# EAGLE schematic gate (EAGLE 9.3.2)
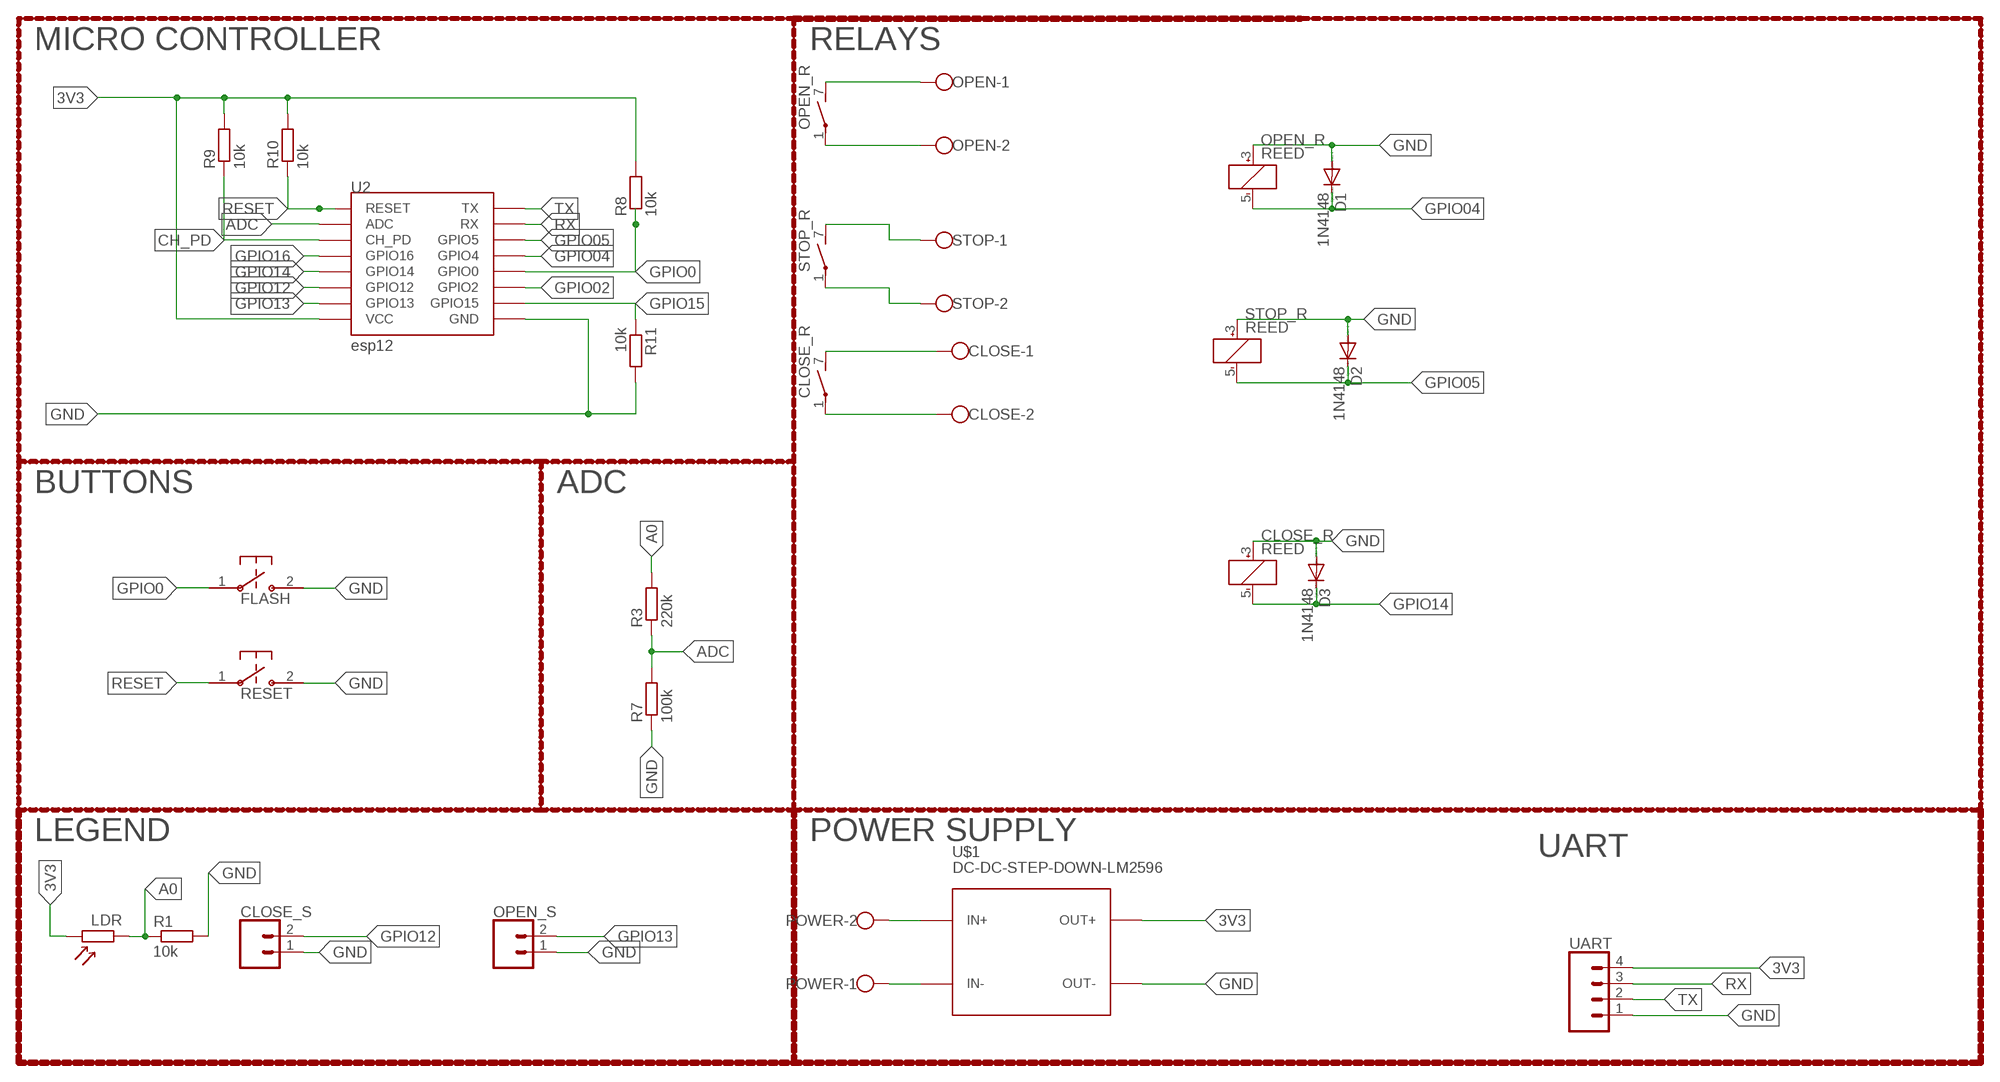
[diagram p0: schematic, sheet 1]

## Parts
CLOSE  W237-102  [W237-102]
CLOSE_R  REED  [REED]
CLOSE_S  CONN_023.5MM  [SCREWTERMINAL-3.5MM-2]
D1  1N4148  DIODE-SOD80C  [SOD80C]
D2  1N4148  DIODE-SOD80C  [SOD80C]
D3  1N4148  DIODE-SOD80C  [SOD80C]
FLASH  B3U-1000P-2P-SMD  B3U-1000P  [B3U-1000P]
LDR  LDR-TH  [1X02]
OPEN  W237-102  [W237-102]
OPEN_R  REED  [REED]
OPEN_S  CONN_023.5MM  [SCREWTERMINAL-3.5MM-2]
POWER  W237-102  [W237-102]
R1  10k  R-EU_R0603  [R0603]
R3  220k  R-EU_R0603  [R0603]
R7  100k  R-EU_R0603  [R0603]
R8  10k  R-EU_R0603  [R0603]
R9  10k  R-EU_R0603  [R0603]
R10  10k  R-EU_R0603  [R0603]
R11  10k  R-EU_R0603  [R0603]
RESET  B3U-1000P-2P-SMD  B3U-1000P  [B3U-1000P]
STOP  W237-102  [W237-102]
STOP_R  REED  [REED]
U2  esp12  ESP12SMD  [ESP12-SMD]
U$1  DC-DC-STEP-DOWN-LM2596  [DC-DC-STEP-DOWN-LM2596]
UART  CONN_04SCREW  [SCREWTERMINAL-3.5MM-4]

## Nets
3V3: LDR.2 R8.2 R9.2 R10.2 U2.VCC U$1.OUT+ UART.4
A0: LDR.1 R1.1 R3.2
ADC: R3.1 R7.2 U2.ADC
CH_PD: R9.1 U2.CH_PD
GND: CLOSE_R.3(1:+) CLOSE_S.1 D1.A D2.A D3.A FLASH.2 OPEN_R.3(1:+) OPEN_S.1 POWER.1 R1.2 R7.1 R11.2 RESET.2 STOP_R.3(1:+) U2.GND U$1.IN- U$1.OUT- UART.1
GND1: OPEN.1 OPEN_R.7(2:S)
GND2: STOP.1 STOP_R.7(2:S)
GND3: CLOSE.1 CLOSE_R.7(2:S)
GPIO0: FLASH.1 R8.1 U2.GPIO0
GPIO02: U2.GPIO2
GPIO04: D1.C OPEN_R.5(1:-) U2.GPIO4
GPIO05: D2.C STOP_R.5(1:-) U2.GPIO5
GPIO12: CLOSE_S.2 U2.GPIO12
GPIO13: OPEN_S.2 U2.GPIO13
GPIO14: CLOSE_R.5(1:-) D3.C U2.GPIO14
GPIO15: R11.1 U2.GPIO15
GPIO16: U2.GPIO16
N$1: OPEN.2 OPEN_R.1(2:P)
N$2: STOP.2 STOP_R.1(2:P)
N$3: CLOSE.2 CLOSE_R.1(2:P)
N$17: POWER.2 U$1.IN+
RESET: R10.1 RESET.1 U2.RESET
RX: U2.RXD0(RX) UART.3
TX: U2.TXD0(TX) UART.2

## Notes on the sheet
- MICRO CONTROLLER | RELAYS
- BUTTONS | ADC
- LEGEND | POWER SUPPLY
- UART

## Library data of the parts
CLOSE OPEN POWER STOP = con-wago-500:W237-102: WAGO SCREW CLAMP; MPN: 237-102; OC_FARNELL: unknown; OC_NEWARK: 70K9898
CLOSE_R OPEN_R STOP_R = relay:REED: RELAY reed, 1 x norm. open with polarity, grid 5.08; OC_FARNELL: unknown; OC_NEWARK: unknown
CLOSE_S OPEN_S = SparkFun-Connectors:CONN_02: Multi connection point. Often used as Generic Header-pin footprint for 0.1 inch spaced/style header connections On any of the 0.1 inch spaced packages, you can populate with these: Break Away Headers - Straight <https://www.sparkfun.com/products/116> (PRT-00116) Break Away Male Headers - Right Angle <https://www.sparkfun.com/products/553> (PRT-00553) Female Headers <https://www.sparkfun.com/products/115> (PRT-00115) Break Away Headers - Machine Pin <https://www.sparkfun.com/products/117> (PRT-00117) Break Away Female Headers - Swiss Machine Pin <https://www.sparkfun.com/products/743> (PRT-00743) For SCREWTERMINALS and SPRING TERMINALS visit here: Screw Terimnals on SparkFun.com <https://www.sparkfun.com/search/results?term=Screw+Terminals> (5mm/3.5mm/2.54mm spacing) This device is also useful as a general connection point to wire up your design to another part of your project. Our various solder wires solder well into these plated through hole pads. Hook-Up Wire - Assortment (Stranded, 22 AWG) <https://www.sparkfun.com/products/11375> (PRT-11375) Hook-Up Wire - Assortment (Solid Core, 22 AWG) <https://www.sparkfun.com/products/11367> (PRT-11367) View the entire wire category on our website here <https://www.sparkfun.com/categories/141> Special notes: Molex polarized connector foot print use with: PRT-08233 with associated crimp pins and housings. 2.54_SCREWTERM for use with PRT-10571. 3.5mm Screw Terminal footprints for PRT-08084 5mm Screw Terminal footprints for use with PRT-08432; PROD_ID: CONN-08399
D1-D3 = diode:DIODE-: DIODE
FLASH = switches:B3U: Switch; DIGIKEY: SW1020CT-ND; MANUFACTURER: Omron; MPN: B3U-1000P; SPICEPREFIX: F
LDR = kanflo:LDR: Through hole light dependent resistor.
R1 R3 R7-R11 = resistor:R-EU_: RESISTOR, European symbol
RESET = switches:B3U: Switch; DIGIKEY: SW1020CT-ND; MANUFACTURER: Omron; MPN: B3U-1000P
U2 = esp8266modules:ESP12: ESP8266 Wifi module 12
U$1 = diy-modules:DC-DC-STEP-DOWN-LM2596: DC/DC Step-Down Regulator based on LM2596-ADJ chip LM2596 datasheet available here: http://www.ti.com/lit/ds/symlink/lm2596.pdf Click here to find device on ebay.com <http://www.ebay.com/sch/lm2596+power+regulator>
UART = SparkFun-Connectors:CONN_04: Multi connection point. Often used as Generic Header-pin footprint for 0.1 inch spaced/style header connections On any of the 0.1 inch spaced packages, you can populate with these: Break Away Headers - Straight <https://www.sparkfun.com/products/116> (PRT-00116) Break Away Male Headers - Right Angle <https://www.sparkfun.com/products/553> (PRT-00553) Female Headers <https://www.sparkfun.com/products/115> (PRT-00115) Break Away Headers - Machine Pin <https://www.sparkfun.com/products/117> (PRT-00117) Break Away Female Headers - Swiss Machine Pin <https://www.sparkfun.com/products/743> (PRT-00743) For SCREWTERMINALS and SPRING TERMINALS visit here: Screw Terimnals on SparkFun.com <https://www.sparkfun.com/search/results?term=Screw+Terminals> (5mm/3.5mm/2.54mm spacing) This device is also useful as a general connection point to wire up your design to another part of your project. Our various solder wires solder well into these plated through hole pads. Hook-Up Wire - Assortment (Stranded, 22 AWG) <https://www.sparkfun.com/products/11375> (PRT-11375) Hook-Up Wire - Assortment (Solid Core, 22 AWG) <https://www.sparkfun.com/products/11367> (PRT-11367) View the entire wire category on our website here <https://www.sparkfun.com/categories/141> Special notes: Molex polarized connector foot print use with SKU : PRT-08231 with associated crimp pins and housings. 1MM SMD Version SKU: PRT-10208; PROD_ID: 2xCONN-08399; SF_ID: 2xPRT-08084

## Net classes
1 220V: width 1.27 mm, clearance 2 mm